# EAGLE design ece411-t15-light-sensitive-alarm-clock (EAGLE 9.2.0)
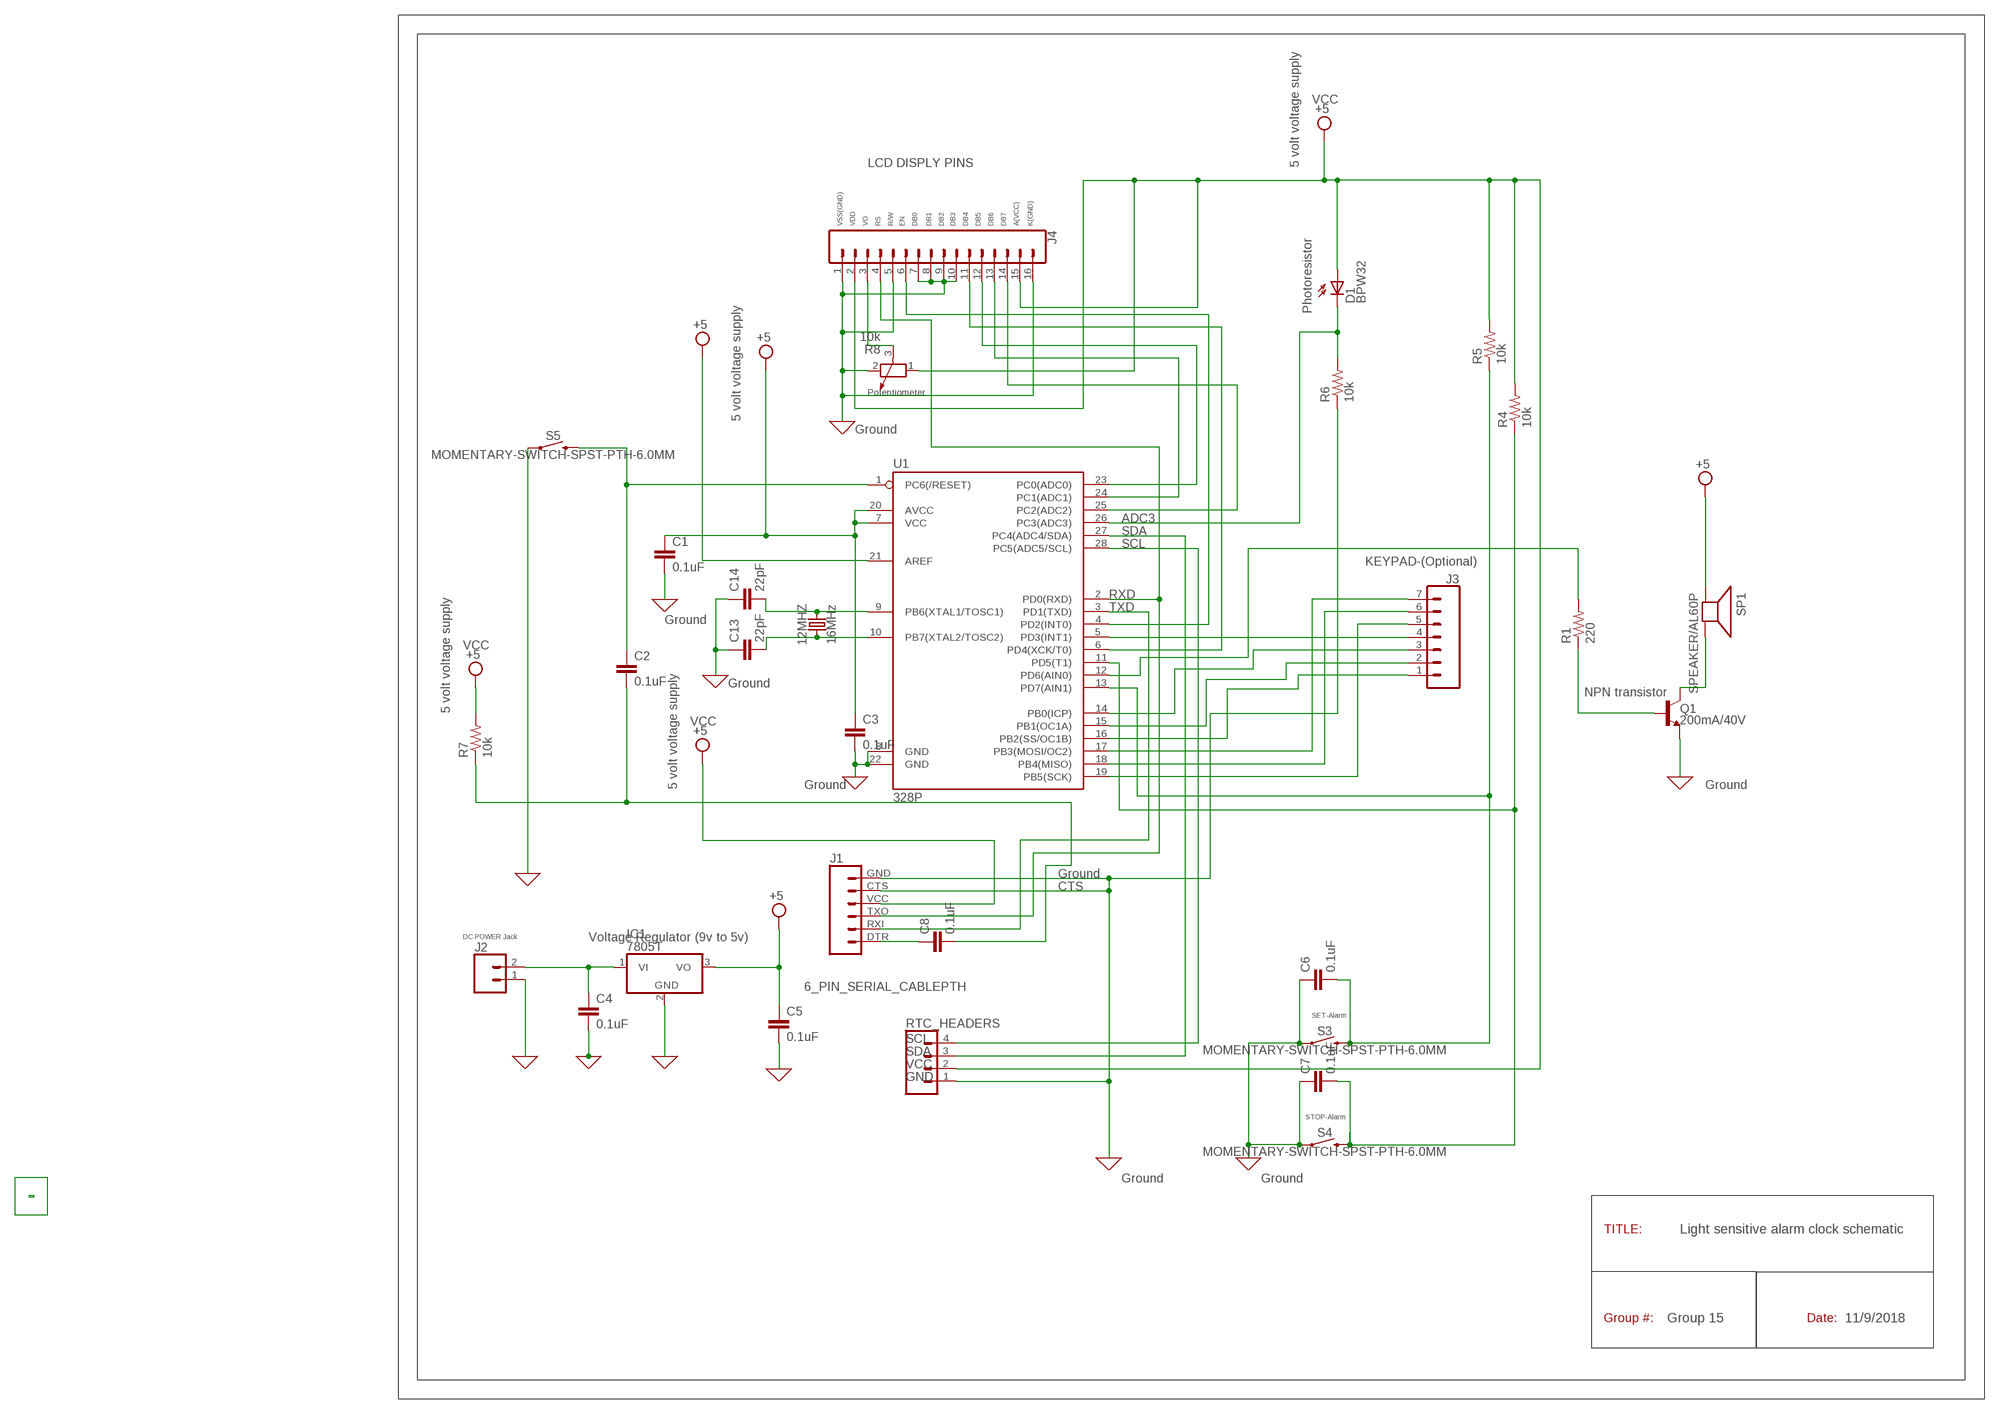
[diagram p0: schematic, sheet 1]

## Parts
12MHZ  16MHz  CRYSTALPTH-2X6  [CRYSTAL-PTH-2X6-CYL]
C1  0.1uF  0.1UF-0603-25V-(+80/-20%)  [0603]
C2  0.1uF  0.1UF-0603-25V-(+80/-20%)  [0603]
C3  0.1uF  0.1UF-0603-25V-(+80/-20%)  [0603]
C4  0.1uF  0.1UF-0603-25V-(+80/-20%)  [0603]
C5  0.1uF  0.1UF-0603-25V-(+80/-20%)  [0603]
C6  0.1uF  0.1UF-0603-25V-(+80/-20%)  [0603]
C7  0.1uF  0.1UF-0603-25V-(+80/-20%)  [0603]
C8  0.1uF  0.1UF-0603-25V-(+80/-20%)  [0603]
C13  22pF  22PF-0603-50V-5%  [0603]
C14  22pF  22PF-0603-50V-5%  [0603]
D1  BPW32  [BPW32]
IC1  7805T  [TO220H]
J1  6_PIN_SERIAL_CABLEPTH  [FTDI_BASIC]
J2  CONN_02  [1X02]
J3  CONN_07  [1X07]
J4  CONN_16  [1X16]
Q1  200mA/40V  TRANS_NPN-2N3904  [TO-92]
R1  220  R-US_R0603  [R0603]
R4  10k  R-US_R0603  [R0603]
R5  10k  R-US_R0603  [R0603]
R6  10k  R-US_R0603  [R0603]
R7  10k  R-US_R0603  [R0603]
R8  10k  POTENTIOMETER_PT-10  [PT-10]
RTC_HEADERS  CONN_04  [1X04]
S3  MOMENTARY-SWITCH-SPST-PTH-6.0MM  [TACTILE_SWITCH_PTH_6.0MM]
S4  MOMENTARY-SWITCH-SPST-PTH-6.0MM  [TACTILE_SWITCH_PTH_6.0MM]
S5  MOMENTARY-SWITCH-SPST-PTH-6.0MM  [TACTILE_SWITCH_PTH_6.0MM]
SP1  SPEAKER/AL60P  [AL60P]
U1  328P  ATMEGA328P_PDIP  [DIP28]

## Nets
0: C1.2 C3.2 C4.2 C5.2 C6.1 C7.1 C13.1 C14.1 IC1.2(GND) J1.CTS J1.GND J2.1 J4.1 J4.5 J4.7 J4.8 J4.9 J4.10 J4.16 Q1.1(E) R6.1 R8.2 RTC_HEADERS.1 S3.1 S4.1 S5.1 U1.8(GND) U1.22(GND) ; supply symbol labelled GND
ADC0: C7.2 R4.1 S4.3 U1.11(PD5(T1))
ADC1: C6.2 R5.1 S3.3 U1.13(PD7(AIN1))
N$1: 12MHZ.2 C14.2 U1.9(PB6(XTAL1/TOSC1))
N$2: 12MHZ.1 C13.2 U1.10(PB7(XTAL2/TOSC2))
N$3: Q1.3(C) SP1.2(-)
N$4: Q1.2(B) R1.1
N$5: RTC_HEADERS.3 U1.27(PC4(ADC4/SDA))
N$6: C4.1 IC1.1(VI) J2.2
N$7: J1.RXI U1.3(PD1(TXD))
N$8: RTC_HEADERS.4 U1.28(PC5(ADC5/SCL))
N$9: J1.TXO J4.4 U1.2(PD0(RXD))
N$10: C8.1 J1.DTR
N$11: J4.3 R8.3
N$12: J4.6 U1.4(PD2(INT0))
N$13: J3.4 U1.5(PD3(INT1))
N$14: R1.2 U1.12(PD6(AIN0))
N$15: J4.12 U1.23(PC0(ADC0))
N$16: J4.13 U1.24(PC1(ADC1))
N$17: D1.K(C) R6.2 U1.26(PC3(ADC3))
N$18: J4.14 U1.25(PC2(ADC2))
N$19: J3.3 U1.14(PB0(ICP))
N$20: C2.2 C8.2 R7.1
N$21: J4.11 U1.6(PD4(XCK/T0))
N$22: J3.2 U1.15(PB1(OC1A))
N$23: J3.1 U1.16(PB2(SS/OC1B))
N$24: C2.1 S5.3 U1.1(PC6(/RESET))
N$25: J3.7 U1.17(PB3(MOSI/OC2))
N$26: J3.6 U1.18(PB4(MISO))
N$27: J3.5 U1.19(PB5(SCK))
VCC: C1.1 C3.1 C5.1 D1.A IC1.3(VO) J1.VCC J4.2 J4.15 R4.2 R5.2 R7.2 R8.1 RTC_HEADERS.2 SP1.1(+) U1.7(VCC) U1.20(AVCC) U1.21(AREF) ; supply symbol labelled +5

## Notes on the sheet
- VCC
- LCD DISPLY PINS | 5 volt voltage supply
- VSS(GND) | VDD | VO | RS | R/W | EN | DB0 | DB1 | DB2 | DB3 | DB4 | DB5 | DB6 | DB7 | A(VCC) | K(GND)
- Photoresistor
- Potentiometer
- 5 volt voltage supply
- Ground
- ADC3
- SDA
- SCL
- KEYPAD-(Optional)
- RXD
- TXD
- Ground
- VCC
- Ground | NPN transistor
- 5 volt voltage supply
- VCC
- 5 volt voltage supply | Ground | Ground
- Ground
- CTS
- DC POWER Jack
- Voltage Regulator (9v to 5v)
- SET-Alarm
- SCL
- SDA
- VCC
- GND
- STOP-Alarm
- Ground | Ground
- TITLE: | Light sensitive alarm clock schematic
- Group #: | Group 15 | Date: | 11/9/2018

## Library data of the parts
12MHZ = SparkFun-Clocks:CRYSTAL: Crystals (Generic) These are passive quartz crystals, which can be used as a clock source for a microcontroller. Crystal's are two-terminal devices. They require external "load" capacitors to generate an oscillating signal.
C1-C8 = SparkFun-Capacitors:0.1UF: 0.1µF ceramic capacitors A capacitor is a passive two-terminal electrical component used to store electrical energy temporarily in an electric field.; PROD_ID: CAP-00810
C13 C14 = SparkFun-Capacitors:22PF: 22pF ceramic capacitors A capacitor is a passive two-terminal electrical component used to store electrical energy temporarily in an electric field.; PROD_ID: CAP-07876
D1 = opto-trans-siemens:BPW32: PHOTO DIODE; OC_FARNELL: unknown; OC_NEWARK: unknown
IC1 = linear:78*: Positive VOLTAGE REGULATOR Source: http://cache.national.com/ds/LM/LM78L05.pdf http://www.fairchildsemi.com/ds/LM/LM7805.pdf
J1 = SparkFun-Connectors:6_PIN_SERIAL_CABLE: 6-pin header connection for use with the "FTDI BASIC" pinout - CABLE SIDE. Also known as "Arduino Serial Program Header". This is used on a design to provide a 6-pin connection point for serial communication usually from a USB cable (D+/D-) to these headers (RX/TX). It also has the remaining pins necessary for programming in the Arduino evironment (DTR, GND, and sometimes VCC). Note, this device has "CABLE" in the name. It is intended to be used on a design that usually lives on the end of your USB cable and prvides the converter chip (FTDI232 or FTDI231x) to commnicate serial RX/TX. The "sister" device, named "TARGET" is inteneded to be used on a design that contains a target micro-controller that you wish to program. You can populate with some of these: Female Headers <https://www.sparkfun.com/products/115> (PRT-00115) For reference (or to suit your programming needs) check out these designs: SparkFun FTDI Basic Breakout - 5V <https://www.sparkfun.com/products/9716> (DEV-09716) SparkFun FTDI Basic Breakout - 3.3V <https://www.sparkfun.com/products/9873> (DEV-09873) SparkFun FTDI SmartBasic <https://www.sparkfun.com/products/12935> (DEV-12935) SparkFun Beefy 3 - FTDI Basic Breakout <https://www.sparkfun.com/products/13746> (DEV-13746)
J2 = SparkFun-Connectors:CONN_02: Multi connection point. Often used as Generic Header-pin footprint for 0.1 inch spaced/style header connections On any of the 0.1 inch spaced packages, you can populate with these: Break Away Headers - Straight <https://www.sparkfun.com/products/116> (PRT-00116) Break Away Male Headers - Right Angle <https://www.sparkfun.com/products/553> (PRT-00553) Female Headers <https://www.sparkfun.com/products/115> (PRT-00115) Break Away Headers - Machine Pin <https://www.sparkfun.com/products/117> (PRT-00117) Break Away Female Headers - Swiss Machine Pin <https://www.sparkfun.com/products/743> (PRT-00743) For SCREWTERMINALS and SPRING TERMINALS visit here: Screw Terimnals on SparkFun.com <https://www.sparkfun.com/search/results?term=Screw+Terminals> (5mm/3.5mm/2.54mm spacing) This device is also useful as a general connection point to wire up your design to another part of your project. Our various solder wires solder well into these plated through hole pads. Hook-Up Wire - Assortment (Stranded, 22 AWG) <https://www.sparkfun.com/products/11375> (PRT-11375) Hook-Up Wire - Assortment (Solid Core, 22 AWG) <https://www.sparkfun.com/products/11367> (PRT-11367) View the entire wire category on our website here <https://www.sparkfun.com/categories/141> Special notes: Molex polarized connector foot print use with: PRT-08233 with associated crimp pins and housings. 2.54_SCREWTERM for use with PRT-10571. 3.5mm Screw Terminal footprints for PRT-08084 5mm Screw Terminal footprints for use with PRT-08432
J3 = SparkFun-Connectors:CONN_07: Multi connection point. Often used as Generic Header-pin footprint for 0.1 inch spaced/style header connections On any of the 0.1 inch spaced packages, you can populate with these: Break Away Headers - Straight <https://www.sparkfun.com/products/116> (PRT-00116) Break Away Male Headers - Right Angle <https://www.sparkfun.com/products/553> (PRT-00553) Female Headers <https://www.sparkfun.com/products/115> (PRT-00115) Break Away Headers - Machine Pin <https://www.sparkfun.com/products/117> (PRT-00117) Break Away Female Headers - Swiss Machine Pin <https://www.sparkfun.com/products/743> (PRT-00743) For SCREWTERMINALS and SPRING TERMINALS visit here: Screw Terimnals on SparkFun.com <https://www.sparkfun.com/search/results?term=Screw+Terminals> (5mm/3.5mm/2.54mm spacing) This device is also useful as a general connection point to wire up your design to another part of your project. Our various solder wires solder well into these plated through hole pads. Hook-Up Wire - Assortment (Stranded, 22 AWG) <https://www.sparkfun.com/products/11375> (PRT-11375) Hook-Up Wire - Assortment (Solid Core, 22 AWG) <https://www.sparkfun.com/products/11367> (PRT-11367) View the entire wire category on our website here <https://www.sparkfun.com/categories/141> Special notes: Molex polarized connector foot print use with SKU : PRT-08231 with associated crimp pins and housings. 1MM SMD Version SKU: PRT-10208 NOTES ON THE VARIANTS LOCK and LOCK_LONGPADS... This footprint was designed to help hold the alignment of a through-hole component (i.e. 6-pin header) while soldering it into place. You may notice that each hole has been shifted either up or down by 0.005 of an inch from it's more standard position (which is a perfectly straight line). This slight alteration caused the pins (the squares in the middle) to touch the edges of the holes. Because they are alternating, it causes a "brace" to hold the component in place. 0.005 has proven to be the perfect amount of "off-center" position when using our standard breakaway headers. Although looks a little odd when you look at the bare footprint, once you have a header in there, the alteration is very hard to notice. Also,if you push a header all the way into place, it is covered up entirely on the bottom side.
J4 = SparkFun-Connectors:CONN_16: Multi connection point. Often used as Generic Header-pin footprint for 0.1 inch spaced/style header connections On any of the 0.1 inch spaced packages, you can populate with these: Break Away Headers - Straight <https://www.sparkfun.com/products/116> (PRT-00116) Break Away Male Headers - Right Angle <https://www.sparkfun.com/products/553> (PRT-00553) Female Headers <https://www.sparkfun.com/products/115> (PRT-00115) Break Away Headers - Machine Pin <https://www.sparkfun.com/products/117> (PRT-00117) Break Away Female Headers - Swiss Machine Pin <https://www.sparkfun.com/products/743> (PRT-00743) For SCREWTERMINALS and SPRING TERMINALS visit here: Screw Terimnals on SparkFun.com <https://www.sparkfun.com/search/results?term=Screw+Terminals> (5mm/3.5mm/2.54mm spacing) This device is also useful as a general connection point to wire up your design to another part of your project. Our various solder wires solder well into these plated through hole pads. Hook-Up Wire - Assortment (Stranded, 22 AWG) <https://www.sparkfun.com/products/11375> (PRT-11375) Hook-Up Wire - Assortment (Solid Core, 22 AWG) <https://www.sparkfun.com/products/11367> (PRT-11367) View the entire wire category on our website here <https://www.sparkfun.com/categories/141> Special notes: Molex polarized connector foot print use with SKU : PRT-08231 with associated crimp pins and housings. 1MM SMD Version SKU: PRT-10208 NOTES ON THE VARIANTS LOCK and LOCK_LONGPADS... This footprint was designed to help hold the alignment of a through-hole component (i.e. 6-pin header) while soldering it into place. You may notice that each hole has been shifted either up or down by 0.005 of an inch from it's more standard position (which is a perfectly straight line). This slight alteration caused the pins (the squares in the middle) to touch the edges of the holes. Because they are alternating, it causes a "brace" to hold the component in place. 0.005 has proven to be the perfect amount of "off-center" position when using our standard breakaway headers. Although looks a little odd when you look at the bare footprint, once you have a header in there, the alteration is very hard to notice. Also,if you push a header all the way into place, it is covered up entirely on the bottom side.
Q1 = SparkFun-DiscreteSemi:TRANS_NPN: NPN transistor Current controlled devices typically used to amplify current or used as a switch. BC547 - COM-08928 <http://www.sparkfun.com/products/8928> (TO-92 45V 100mA) (1.Collector 2.Base 3.Emitter) 2N3904 - COM-00521 <http://www.sparkfun.com/products/521> (TO-92 40V 200mA) (1.Emitter 2.Base 3.Collector) P2N2222A - COM-12852 <http://www.sparkfun.com/products/12852> (TO-92 40V 600mA) (1.Collector 2.Base 3.Emitter); PROD_ID: TRANS-08447
R1 R4-R7 = rcl:R-US_: RESISTOR, American symbol; SPICEPREFIX: R
R8 = rcl:POTENTIOMETER_: Potentiometer; SPICEMODEL: POT; SPICEPREFIX: X
RTC_HEADERS = SparkFun-Connectors:CONN_04: Multi connection point. Often used as Generic Header-pin footprint for 0.1 inch spaced/style header connections On any of the 0.1 inch spaced packages, you can populate with these: Break Away Headers - Straight <https://www.sparkfun.com/products/116> (PRT-00116) Break Away Male Headers - Right Angle <https://www.sparkfun.com/products/553> (PRT-00553) Female Headers <https://www.sparkfun.com/products/115> (PRT-00115) Break Away Headers - Machine Pin <https://www.sparkfun.com/products/117> (PRT-00117) Break Away Female Headers - Swiss Machine Pin <https://www.sparkfun.com/products/743> (PRT-00743) For SCREWTERMINALS and SPRING TERMINALS visit here: Screw Terimnals on SparkFun.com <https://www.sparkfun.com/search/results?term=Screw+Terminals> (5mm/3.5mm/2.54mm spacing) This device is also useful as a general connection point to wire up your design to another part of your project. Our various solder wires solder well into these plated through hole pads. Hook-Up Wire - Assortment (Stranded, 22 AWG) <https://www.sparkfun.com/products/11375> (PRT-11375) Hook-Up Wire - Assortment (Solid Core, 22 AWG) <https://www.sparkfun.com/products/11367> (PRT-11367) View the entire wire category on our website here <https://www.sparkfun.com/categories/141> Special notes: Molex polarized connector foot print use with SKU : PRT-08231 with associated crimp pins and housings. 1MM SMD Version SKU: PRT-10208; PROD_ID: CONN-09696
S3-S5 = SparkFun-Switches:MOMENTARY-SWITCH-SPST: Momentary Switch (Pushbutton) - SPST Normally-open (NO) SPST momentary switches (buttons, pushbuttons). Variants PTH-12MM - 12mm square, through-hole Momentary Pushbutton Switch - 12mm Square <https://www.sparkfun.com/products/9190> (COM-09190) PTH-6.0MM, PTH-6.0MM-KIT - 6.0mm square, through-hole Mini Pushbutton Switch <https://www.sparkfun.com/products/97> (COM-00097) KIT package intended for soldering kit's - only one side of pads' copper is exposed. PTH-RIGHT-ANGLE-KIT - Right-angle, through-hole Right Angle Tactile Button <https://www.sparkfun.com/products/10791> - Used on SparkFun BigTime Watch Kit <https://www.sparkfun.com/products/11734> SMD-12MM - 12mm square, surface-mount Tactile Button - SMD (12mm) <https://www.sparkfun.com/products/12993> (COM-12993) Used on SparkFun PicoBoard <https://www.sparkfun.com/products/11888> SMD-4.5MM - 4.5mm Square Trackball Switch Used on SparkFun Blackberry Trackballer Breakout <https://www.sparkfun.com/products/13169> SMD-4.6MMX2.8MM - 4.60mm x 2.80mm, surface mount Used on SparkFun SAMD21 Mini Breakout <https://www.sparkfun.com/products/13664> SMD-5.2MM, SMD-5.2-REDUNDANT - 5.2mm square, surface-mount Mini Pushbutton Switch - SMD <https://www.sparkfun.com/products/8720> (COM-08720) Used on Arduino Pro Mini <https://www.sparkfun.com/products/11114> REDUNDANT package connects both switch circuits together SMD-6.0X3.5MM - 6.0 x 3.5mm, surface mount Momentary Reset Switch SMD <https://www.sparkfun.com/products/8229> (COM-08229) SMD-6.2MM-TALL - 6.2mm square, surface mount Tactile Button - SMD (6mm) <https://www.sparkfun.com/products/12992> Used on SparkFun Digital Sandbox <https://www.sparkfun.com/products/12651> SMD-RIGHT-ANGLE - Right-angle, surface mount Used on SparkFun Block for Intel® Edison - Arduino <https://www.sparkfun.com/products/13036>; PROD_ID: SWCH-08441; SF_SKU: COM-00097
SP1 = adafruit:SPEAKER: SPEAKER Source: Buerklin Added PS12 (for part # PS1240 piezo) http://www.ladyada.net/library/pcb/eaglelibrary.html
U1 = SparkFun-IC-Microcontroller:ATMEGA328P_PDIP: Atmel 328P Through hole ATMEGA328P uC used in the Arduino 32kb flash, 1k EEPROM, 2k SRAM Datasheet <http://www.sparkfun.com/datasheets/Components/SMD/ATMega328.pdf> SparkFun Products Storefront component: AVR 28 Pin 20MHz 32K 6A/D - ATMega328P <https://www.sparkfun.com/products/9061> (COM-09061) SparkFun Simon Says - Through-Hole Soldering Kit <https://www.sparkfun.com/products/10547> (KIT-10547) SparkFun Learn to Solder - Simon Says <https://www.sparkfun.com/products/13708> (KIT-13708) SparkFun BigTime Watch Kit <https://www.sparkfun.com/products/11734> (KIT-11734) SparkFun ClockIt <https://www.sparkfun.com/products/10930> (KIT-10930) SparkFun Serial Enabled LCD Kit <https://www.sparkfun.com/products/10097> (LCD-10097) SparkFun Simon Tilts - Through Hole Soldering Kit <https://www.sparkfun.com/products/12634> (KIT-12634) SparkFun Frequency Counter Kit <https://www.sparkfun.com/products/10140> (KIT-10140) FabFM Radio Kit <https://www.sparkfun.com/products/11043> (KIT-11043) SparkFun Binary Blaster Kit <https://www.sparkfun.com/products/12037> (KIT-12037) SparkFun Metro-Gnome <https://www.sparkfun.com/products/9236> (KIT-09236) ATmega328 with Arduino Optiboot (Uno) <https://www.sparkfun.com/products/10524> (DEV-10524); PROD_ID: IC-09136

## Board
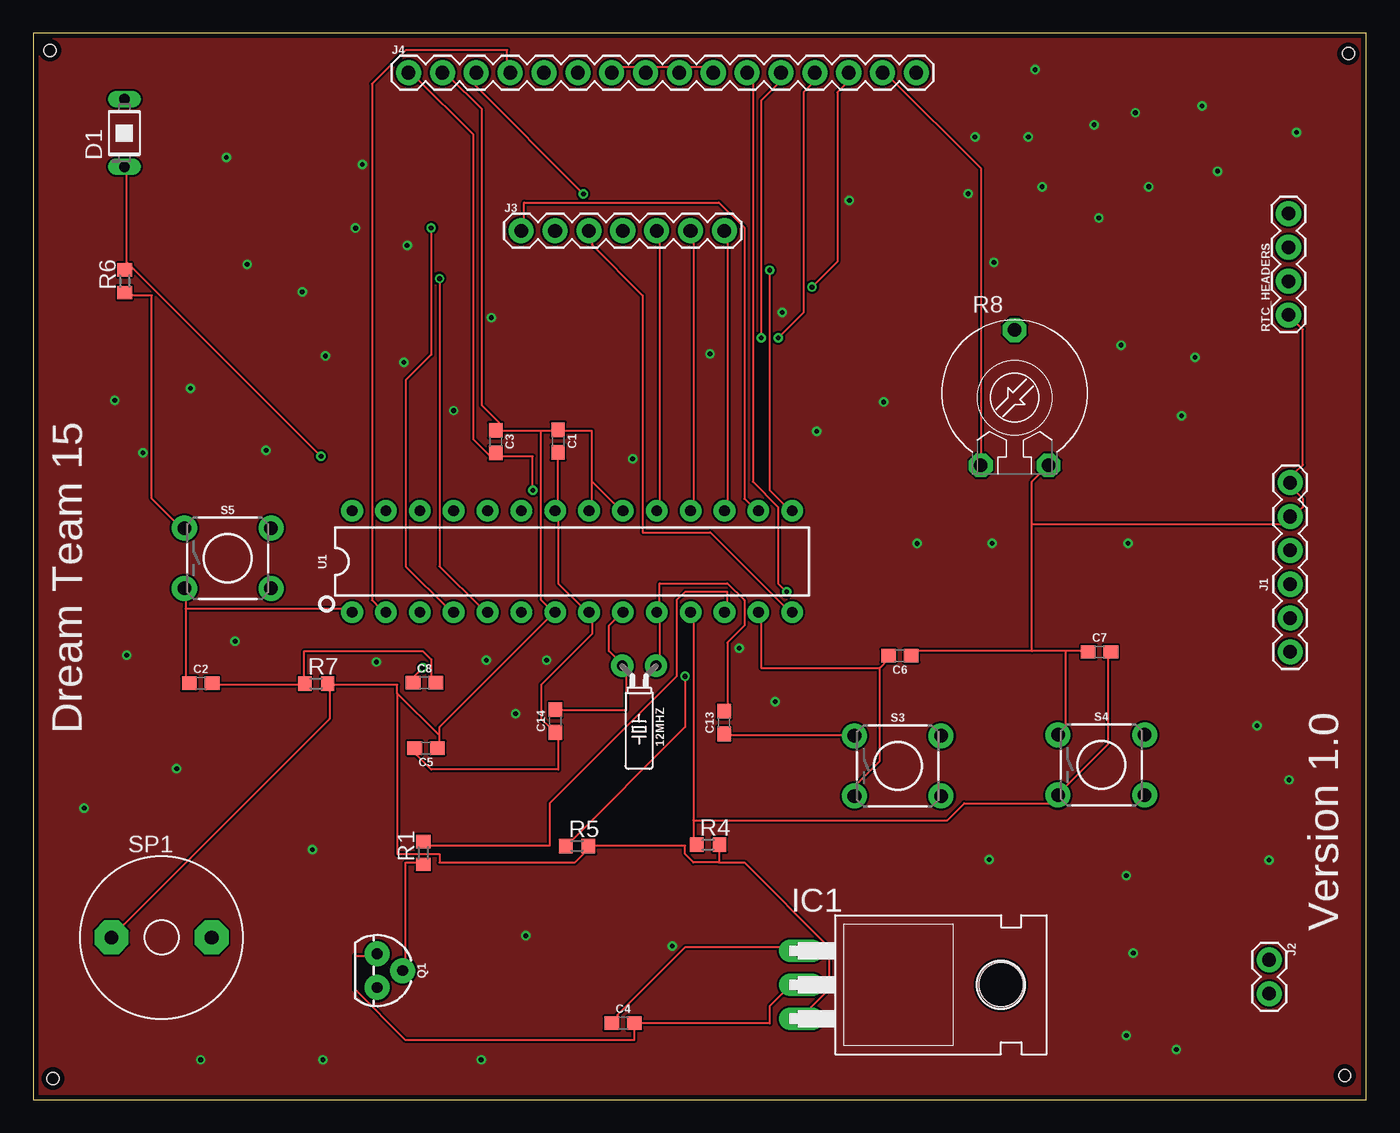
[diagram p1: board, top side]
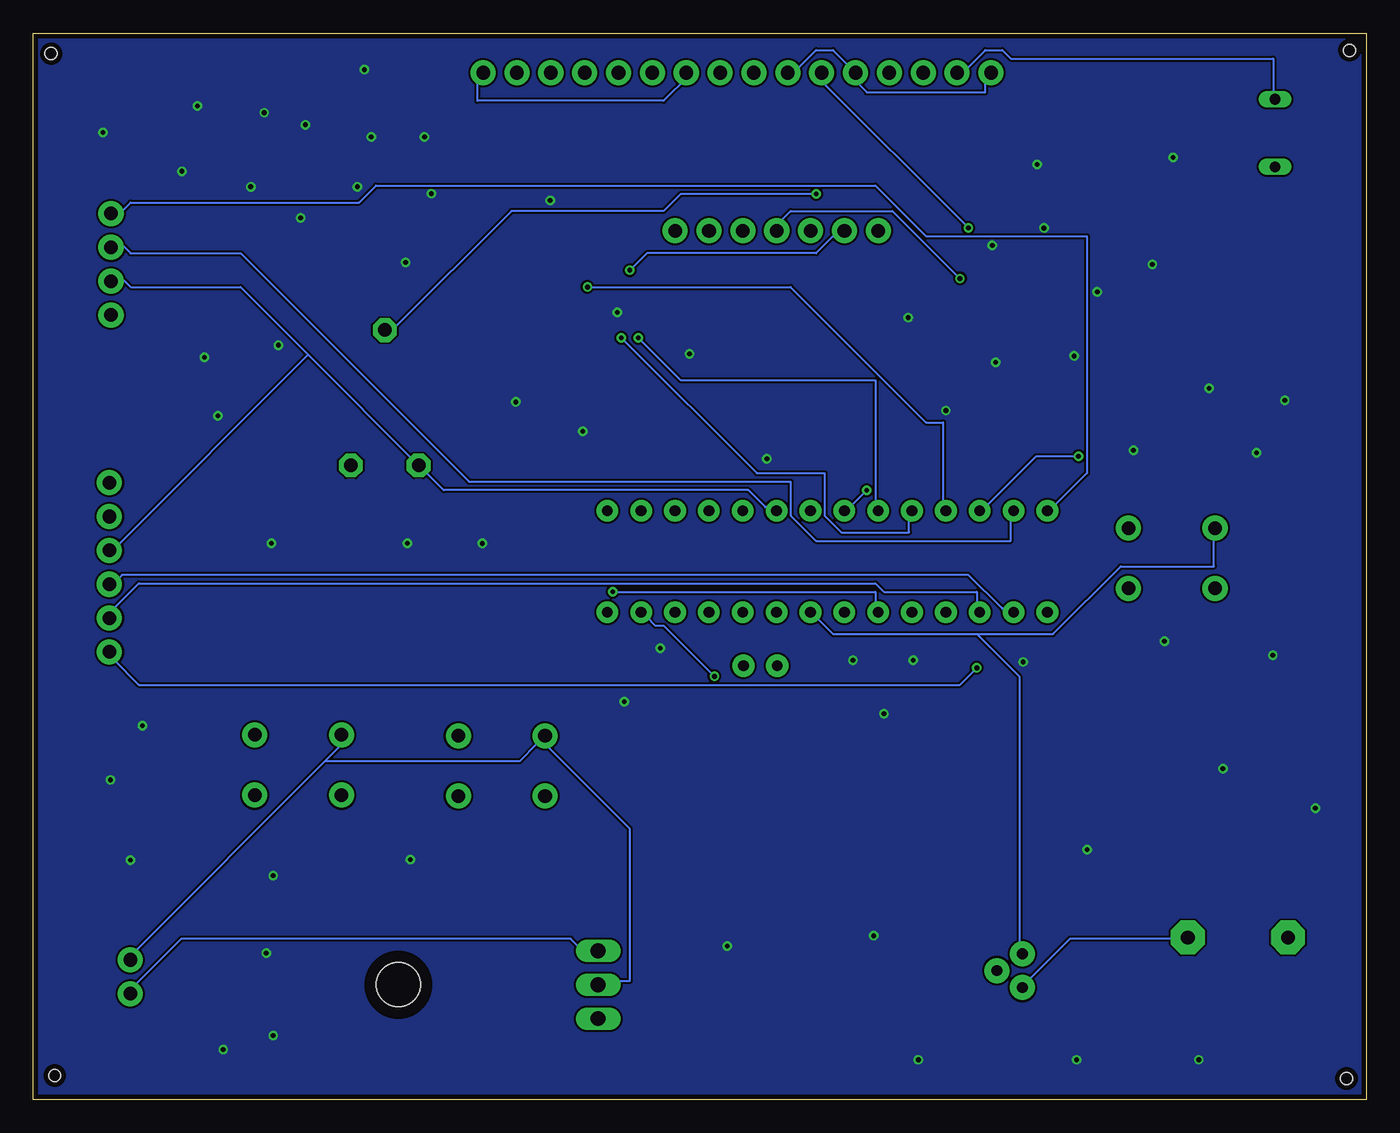
[diagram p2: board, bottom side, seen from below]

Size 100 x 80 mm. Coordinates in mm from the lower left corner, seen from the top.
Outline: 0,0 100,0 100,80 0,80 0,0
Copper layers (1*16): Top 0.0356mm / dielectric 1.5011mm / Bottom 0.0356mm
Design rules "LaenPCBOrder": minimum track width 6mil, minimum drill 13mil, track to track 6mil, track to pad 6mil, pad to pad 6mil, via to via 6mil, smd to smd 6mil, copper to edge 15mil, drill to drill 6mil, minimum pad ring 7mil, minimum via ring 7mil, stop-mask expansion 3mil, vias tented up to drill 0mil, thermal gap 10mil
Holes 0.9 mm at 1.24,78.72 98.66,78.48 98.39,1.79 1.48,1.57

### Footprints (pad centres in the part's own frame; a part is rotated, then mirrored left to right if it is on the bottom)
CRYSTAL-PTH-2X6-CYL = drill 0.813 pad 1.676: 1 -1.27,0; 2 1.27,0
0603 = smd 1.1 x 1: 1 -0.85,0; 2 0.85,0
BPW32 = drill 0.813 long: A 0,2.54; K 0,-2.54
TO220H = drill 1.118 long: 1 -2.54,-10.16; 2 0,-10.16; 3 2.54,-10.16 | hole 3.302: 0,4.826
FTDI_BASIC = drill 1.016 pad 1.88: CTS 10.16,0; DTR 0,0; GND 12.7,0; RXI 2.54,0; TXO 5.08,0; VCC 7.62,0
1X02 = drill 1.016 pad 1.88: 1 0,0; 2 2.54,0
1X07 = drill 1.016 pad 1.88: 1 0,0; 2 2.54,0; 3 5.08,0; 4 7.62,0; 5 10.16,0; 6 12.7,0; 7 15.24,0
1X16 = drill 1.016 pad 1.88: 1 0,0; 2 2.54,0; 3 5.08,0; 4 7.62,0; 5 10.16,0; 6 12.7,0; 7 15.24,0; 8 17.78,0; 9 20.32,0; 10 22.86,0; 11 25.4,0; 12 27.94,0; 13 30.48,0; 14 33.02,0; 15 35.56,0; 16 38.1,0
TO-92 = drill 0.813 pad 1.88: 1 -1.27,0; 2 0,1.905; 3 1.27,0
R0603 = smd 1 x 1.1: 1 -0.85,0; 2 0.85,0
PT-10 = drill 1.016 pad 1.778 octagon: 1 -2.54,-5.08; 2 2.54,-5.08; 3 0,5.08
1X04 = drill 1.016 pad 1.88: 1 0,0; 2 2.54,0; 3 5.08,0; 4 7.62,0
TACTILE_SWITCH_PTH_6.0MM = drill 1.016 pad 1.88: 1 -3.251,2.261; 2 3.251,2.261; 3 -3.251,-2.261; 4 3.251,-2.261
AL60P = drill 1.016 pad 2.54 octagon: 1 -3.759,0; 2 3.759,0
DIP28 = drill 0.813 pad 1.626: 1 -16.51,-3.81; 2 -13.97,-3.81; 3 -11.43,-3.81; 4 -8.89,-3.81; 5 -6.35,-3.81; 6 -3.81,-3.81; 7 -1.27,-3.81; 8 1.27,-3.81; 9 3.81,-3.81; 10 6.35,-3.81; 11 8.89,-3.81; 12 11.43,-3.81; 13 13.97,-3.81; 14 16.51,-3.81; 15 16.51,3.81; 16 13.97,3.81; 17 11.43,3.81; 18 8.89,3.81; 19 6.35,3.81; 20 3.81,3.81; 21 1.27,3.81; 22 -1.27,3.81; 23 -3.81,3.81; 24 -6.35,3.81; 25 -8.89,3.81; 26 -11.43,3.81; 27 -13.97,3.81; 28 -16.51,3.81

### Placement (x,y rotation side)
12MHZ  45.45,32.55 180 top
C1  39.37,49.41 270 top
C2  12.56,31.23 0 top
C3  34.69,49.36 270 top
C4  44.25,5.73 0 top
C5  29.46,26.37 180 top
C6  65.02,33.3 180 top
C7  80,33.58 0 top
C8  29.34,31.26 0 top
C13  51.83,28.28 90 top
C14  39.16,28.39 90 top
D1  6.83,72.52 0 top
IC1  67.78,8.61 270 top
J1  94.29,33.58 90 top
J2  92.72,10.48 270 top
J3  36.6,65.18 0 top
J4  28.15,77.04 0 top
Q1  25.8,9.67 270 top
R1  29.25,18.5 90 top
R4  50.63,19.12 0 top
R5  40.8,19.02 0 top
R6  6.86,61.4 90 top
R7  21.23,31.21 0 top
R8  73.63,52.66 0 top
RTC_HEADERS  94.18,58.86 90 top
S3  64.86,25.03 0 top
S4  80.13,25.1 0 top
S5  14.59,40.61 0 top
SP1  9.62,12.16 0 top
U1  40.43,40.37 0 top

### Tracks (layer width: path | path; a pad name or v marks a point on that pad's centre or on a via)
0  (via drill 0.35)
  Top 0.152: RTC_HEADERS.1 94.61,58.42 95.25,57.78 95.25,47.62 94.61,46.99 94.61,46.35 J1.GND 94.61,45.72 95.25,45.09 95.25,44.45 94.61,43.81 J1.CTS 93.98,43.18 74.93,43.18 | 77.47,33.66 78.74,33.66 C7.1 | 77.47,33.66 74.93,33.66 | 74.93,33.66 66.04,33.66 C6.1 | 74.93,33.66 74.93,43.18 | 74.93,43.18 74.93,46.35 75.56,46.99 R8.2 | C13.1 52.07,27.3 61.59,27.3 S3.1 | 77.47,33.66 77.47,27.94 S4.1 | J4.7 43.81,77.47 45.72,77.47 J4.8 46.35,77.47 48.26,77.47 J4.9 48.9,77.47 50.8,77.47 J4.10 | 45.09,5.71 55.24,5.71 55.24,6.99 57.15,8.89 IC1.2 | 45.09,5.71 45.09,4.45 27.94,4.45 24.13,8.26 24.13,10.79 25.4,10.79 Q1.1 | 45.09,5.71 C4.2 | R6.1 6.99,60.33 8.89,60.33 8.89,45.09 10.79,43.18 S5.1 | C5.2 28.57,26.04 29.84,24.77 39.37,24.77 39.37,27.3 C14.1 38.73,27.94 38.1,28.57 38.1,31.11 41.91,34.92 41.91,36.2 U1.8 41.27,36.83 39.37,38.73 39.37,43.81 U1.22 39.37,44.45 39.37,48.26 C1.2 | v37.47,45.72 37.47,48.26 34.92,48.26 C3.2 34.29,48.26 33.02,49.53 33.02,72.39 28.57,76.83 J4.1
  Bottom 0.152: 78.11,25.4 76.83,26.67 76.83,27.3 S4.1 | 78.11,25.4 92.71,10.79 J2.1 | 78.11,25.4 63.5,25.4 62.23,26.67 S3.1 61.59,26.67 55.24,20.32 55.24,8.89 57.15,8.89 IC1.2 | J4.1 28.57,76.83 28.57,75.56 37.47,75.56 38.73,76.83 J4.5 38.73,77.47 40.01,78.74 41.27,78.74 42.55,77.47 43.18,77.47 J4.7 | J4.16 66.67,76.83 66.67,74.93 52.7,74.93 50.8,76.83 J4.10 | v37.47,45.72 38.73,44.45 U1.22 | 29.21,34.92 40.01,34.92 41.27,36.2 U1.8 | 29.21,34.92 23.5,34.92 18.41,40.01 11.43,40.01 11.43,42.55 S5.1 | 29.21,34.92 26.04,31.75 26.04,11.43 Q1.1
ADC0
  Top 0.152: C7.2 80.64,33.66 80.64,26.67 77.47,23.5 77.47,22.86 S4.3 76.83,22.23 69.85,22.23 68.58,20.95 49.53,20.95 | 49.53,20.95 49.53,36.2 U1.11 | 49.53,20.95 49.53,19.05 R4.1
ADC1  (via drill 0.35)
  Top 0.152: 63.5,32.38 64.14,33.02 C6.2 | 63.5,32.38 63.5,25.4 61.59,23.5 61.59,22.86 S3.3 | v48.9,31.75 48.9,27.94 40.01,19.05 R5.1 | 63.5,32.38 54.61,32.38 54.61,36.2 U1.13
  Bottom 0.152: v48.9,31.75 52.7,35.56 53.34,35.56 53.98,36.2 U1.13
GND  (via drill 0.35)
  other vias: 82.68,74.04 79.58,73.14 74.65,72.23 75.68,68.49 83.69,68.49 79.94,66.16 72.07,62.8 70.65,72.23 70.13,67.97 75.17,77.27 87.69,74.56 88.85,69.65 87.17,55.7 86.14,51.3 82.14,41.74 71.94,41.74 91.82,28.05 92.72,17.97 82.01,16.81 82.01,4.79 85.75,3.76 82.53,10.99 47.93,11.51 36.96,12.29 33.6,2.98 21.72,2.98 12.56,2.98 20.95,18.75 10.75,24.82 7.01,33.35 15.14,34.38 25.73,32.83 52.96,33.86 55.67,29.86 36.18,28.95 33.99,32.96 38.51,32.96 58.77,50.14 44.96,48.07 50.77,55.96 56.19,59.06 63.81,52.34 27.79,55.31 34.37,58.67 31.53,51.69 17.46,48.72 20.17,60.61 24.18,65.39 14.49,70.68 24.69,70.17 28.05,64.09 16.04,62.67 6.1,52.47 11.78,53.37 61.23,67.45 81.62,56.6 94.2,23.98 66.32,41.72 94.78,72.57 71.7,18.01 3.81,21.86 8.23,48.53 21.9,55.79
  pour Top: 101.19,82.01 101.19,-1.38 -1.57,-1.38 -1.57,82.01 -1.57,82.01
  pour Bottom: -2.29,82.75 -2.29,-2.14 103.04,-2.14 103.04,82.79 -2.28,82.79
N$1
  Top 0.152: C14.2 39.37,29.21 44.45,29.21 44.45,32.38 12MHZ.2 43.81,33.02 43.18,33.66 43.18,35.56 43.81,36.2 U1.9
N$2
  Top 0.152: C13.2 52.07,29.21 52.07,34.29 53.34,35.56 53.34,37.47 52.07,38.73 46.99,38.73 46.99,36.83 U1.10 46.99,36.2 46.99,33.02 12MHZ.1
N$3
  Bottom 0.152: Q1.3 25.4,8.89 22.23,12.06 13.97,12.06 SP1.2
N$4
  Top 0.152: R1.1 29.21,17.78 27.94,17.78 27.94,10.16 Q1.2
N$5
  Bottom 0.152: U1.27 26.67,43.81 26.67,41.91 41.27,41.91 43.18,43.81 43.18,46.35 67.31,46.35 84.45,63.5 92.71,63.5 93.34,64.14 93.98,64.14 RTC_HEADERS.3
N$6
  Top 0.152: C4.1 43.81,5.71 43.81,6.35 48.9,11.43 57.15,11.43 IC1.1
  Bottom 0.152: J2.2 92.71,8.26 88.9,12.06 59.69,12.06 59.05,11.43 57.78,11.43 IC1.1
N$7
  Bottom 0.152: U1.3 29.21,36.83 29.21,38.1 36.2,38.1 36.83,38.73 92.08,38.73 94.61,36.2 J1.RXI
N$8
  Bottom 0.152: U1.28 23.5,44.45 20.95,46.99 20.95,64.77 33.02,64.77 36.83,68.58 74.3,68.58 75.56,67.31 92.71,67.31 93.34,66.67 93.98,66.67 RTC_HEADERS.4
N$9
  Top 0.152: U1.2 26.04,36.83 25.4,37.47 25.4,76.2 27.94,78.74 35.56,78.74 35.56,77.47 J4.4
  Bottom 0.152: J1.TXO 93.98,38.73 93.34,39.37 29.84,39.37 27.3,36.83 26.67,36.83 U1.2
N$10  (via drill 0.35)
  Top 0.152: v29.21,32.38 28.57,31.75 C8.1
  Bottom 0.152: v29.21,32.38 30.48,31.11 92.08,31.11 93.98,33.02 J1.DTR
N$11  (via drill 0.35)
  Top 0.152: v41.27,67.94 33.02,76.2 33.02,76.83 J4.3
  Bottom 0.152: v41.27,67.94 51.44,67.94 52.7,66.67 64.14,66.67 73.03,57.78 R8.3
N$12  (via drill 0.35)
  Top 0.152: v29.84,65.41 29.84,55.88 27.94,53.98 27.94,40.01 31.11,36.83 U1.4
  Bottom 0.152: v29.84,65.41 41.27,76.83 J4.6
N$13  (via drill 0.35)
  Top 0.152: v30.48,61.59 30.48,40.01 33.66,36.83 U1.5
  Bottom 0.152: v30.48,61.59 35.56,66.67 43.18,66.67 44.45,65.41 J3.4
N$14
  Top 0.152: R1.2 29.21,19.05 38.73,19.05 38.73,22.23 48.26,31.75 48.26,37.47 48.9,38.1 52.07,38.1 52.07,36.83 U1.12
N$15  (via drill 0.35)
  Top 0.152: v54.61,57.15 54.61,74.93 55.88,76.2 55.88,76.83 J4.12
  Bottom 0.152: v54.61,57.15 51.44,53.98 36.83,53.98 36.83,44.45 U1.23
N$16  (via drill 0.35)
  Top 0.152: v55.88,57.15 57.78,59.05 57.78,75.56 58.42,76.2 58.42,76.83 J4.13
  Bottom 0.152: v55.88,57.15 45.72,46.99 40.64,46.99 40.64,43.81 39.37,42.55 34.29,42.55 34.29,43.81 U1.24
N$17  (via drill 0.35)
  Top 0.152: 6.99,62.87 6.99,69.85 D1.K | 6.99,62.87 6.99,62.23 R6.2 | 6.99,62.87 v21.59,48.26
  Bottom 0.152: v21.59,48.26 24.77,48.26 28.57,44.45 U1.26
N$18  (via drill 0.35)
  Top 0.152: v58.42,60.96 60.33,62.87 60.33,75.56 60.96,76.2 60.96,76.83 J4.14
  Bottom 0.152: v58.42,60.96 43.18,60.96 33.02,50.8 31.75,50.8 31.75,44.45 U1.25
N$19
  Top 0.152: U1.14 56.52,36.83 50.8,42.55 45.72,42.55 45.72,60.33 41.91,64.14 41.91,64.77 J3.3
N$20
  Top 0.152: C2.2 13.34,31.11 20.32,31.11 R7.1 20.32,31.75 20.32,33.66 29.21,33.66 29.84,33.02 29.84,31.75 C8.2
N$21  (via drill 0.35)
  Top 0.152: v56.52,38.1 55.88,38.73 55.88,44.45 53.98,46.35 53.98,76.83 J4.11
  Bottom 0.152: v56.52,38.1 36.83,38.1 36.83,36.83 U1.6
N$22  (via drill 0.35)
  Top 0.152: v55.24,62.23 55.24,45.72 56.52,44.45 U1.15
  Bottom 0.152: v55.24,62.23 53.98,63.5 41.27,63.5 40.01,64.77 39.37,64.77 J3.2
N$23
  Top 0.152: U1.16 53.98,44.45 53.34,45.09 53.34,65.41 51.44,67.31 36.83,67.31 36.83,65.41 J3.1
N$24
  Top 0.152: 11.43,36.83 11.43,38.1 S5.3 | 11.43,36.83 11.43,31.11 C2.1 | 11.43,36.83 23.5,36.83 U1.1
N$25
  Top 0.152: U1.17 52.07,44.45 52.07,64.77 J3.7
N$26
  Top 0.152: U1.18 49.53,44.45 49.53,64.77 J3.6
N$27
  Top 0.152: U1.19 46.99,44.45 46.99,64.77 J3.5
VCC
  Top 0.152: J4.15 64.14,76.83 71.12,69.85 71.12,47.62 R8.1 | 51.44,17.78 49.53,17.78 48.9,18.41 48.9,19.05 41.91,19.05 R5.2 41.27,19.05 41.27,18.41 40.64,17.78 30.48,17.78 30.48,18.41 27.3,18.41 27.3,30.48 | 51.44,17.78 51.44,19.05 R4.2 | 51.44,17.78 53.34,17.78 59.69,11.43 59.69,8.26 57.78,6.35 IC1.3 | 39.37,50.16 38.1,50.16 | 38.1,50.16 34.92,50.16 | 39.37,50.16 41.91,50.16 41.91,46.35 | 41.91,46.35 41.91,44.45 U1.21 | 39.37,50.16 C1.1 | 41.91,46.35 43.81,44.45 U1.20 | 22.23,31.11 27.3,31.11 27.3,30.48 | 30.48,27.3 27.3,30.48 | 30.48,27.3 30.48,26.67 C5.1 | 30.48,27.3 30.48,27.94 38.73,36.2 U1.7 38.73,36.83 38.1,37.47 38.1,50.16 | 22.23,31.11 22.23,28.57 6.35,12.7 SP1.1 | 22.23,31.11 R7.2 | 34.92,50.16 34.92,50.8 33.66,52.07 33.66,74.3 31.11,76.83 J4.2 | 34.92,50.16 C3.1
  Bottom 0.152: 79.38,55.88 84.45,60.96 92.71,60.96 93.34,61.59 93.98,61.59 RTC_HEADERS.2 | 79.38,55.88 71.12,47.62 R8.1 70.48,46.99 69.22,45.72 46.35,45.72 45.09,44.45 44.45,44.45 U1.20 | 79.38,55.88 93.98,41.27 J1.VCC | D1.A 6.99,75.56 6.99,78.11 26.67,78.11 27.3,78.74 28.57,78.74 29.84,77.47 30.48,77.47 J4.2

### Text on the board
tPlace: Dream Team 15 | Version 1.0